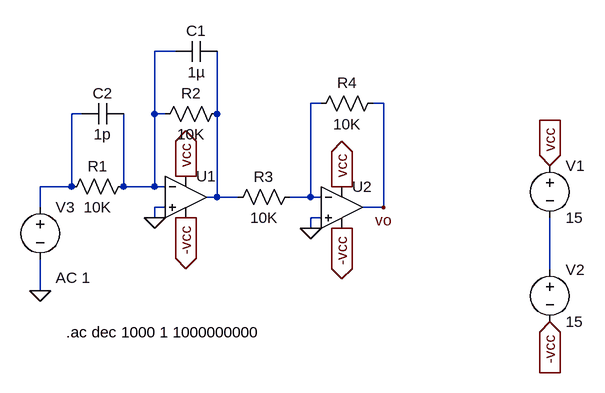
[diagram p0: schematic actividadclase.asc]
actividadclase.asc, the LTspice schematic file:
Version 4.1
SHEET 1 880 680
WIRE -592 -112 -624 -112
WIRE -368 -32 -384 -32
WIRE -272 -32 -288 -32
WIRE -736 -16 -752 -16
WIRE -624 -16 -624 -112
WIRE -608 -16 -624 -16
WIRE -528 -16 -528 -112
WIRE -752 96 -752 -16
WIRE -752 96 -800 96
WIRE -672 96 -672 -16
WIRE -624 96 -624 -16
WIRE -624 96 -672 96
WIRE -608 96 -624 96
WIRE -528 112 -528 -16
WIRE -528 112 -544 112
WIRE -496 112 -528 112
WIRE -384 112 -384 -32
WIRE -384 112 -416 112
WIRE -368 112 -384 112
WIRE -800 128 -800 96
WIRE -608 128 -624 128
WIRE -272 128 -272 -32
WIRE -272 128 -304 128
WIRE -624 144 -624 128
WIRE -368 144 -384 144
WIRE -384 160 -384 144
WIRE -16 224 -16 144
WIRE -800 256 -800 208
FLAG -16 64 vcc
IOPIN -16 64 In
FLAG -16 304 -vcc
IOPIN -16 304 In
FLAG -800 256 0
FLAG -336 96 vcc
IOPIN -336 96 Out
FLAG -576 80 vcc
IOPIN -576 80 Out
FLAG -576 144 -vcc
IOPIN -576 144 Out
FLAG -336 160 -vcc
IOPIN -336 160 Out
FLAG -272 128 vo
FLAG -624 144 0
FLAG -384 160 0
SYMBOL voltage -16 48 R0
SYMATTR InstName V1
SYMATTR Value 15
SYMBOL voltage -16 208 R0
SYMATTR InstName V2
SYMATTR Value 15
SYMBOL res -656 80 R90
WINDOW 0 0 56 VBottom 2
WINDOW 3 32 56 VTop 2
SYMATTR InstName R1
SYMATTR Value 10K
SYMBOL res -512 -32 R90
WINDOW 0 0 56 VBottom 2
WINDOW 3 32 56 VTop 2
SYMATTR InstName R2
SYMATTR Value 10K
SYMBOL res -400 96 R90
WINDOW 0 0 56 VBottom 2
WINDOW 3 32 56 VTop 2
SYMATTR InstName R3
SYMATTR Value 10K
SYMBOL res -272 -48 R90
WINDOW 0 0 56 VBottom 2
WINDOW 3 32 56 VTop 2
SYMATTR InstName R4
SYMATTR Value 10K
SYMBOL voltage -800 112 R0
WINDOW 123 24 124 Left 2
WINDOW 39 0 0 Left 0
SYMATTR InstName V3
SYMATTR Value ""
SYMATTR Value2 AC 1
SYMBOL OpAmps\\UniversalOpAmp2 -576 112 R0
SYMATTR InstName U1
SYMBOL OpAmps\\UniversalOpAmp2 -336 128 R0
SYMATTR InstName U2
SYMBOL cap -528 -128 R90
WINDOW 0 0 32 VBottom 2
WINDOW 3 32 32 VTop 2
SYMATTR InstName C1
SYMATTR Value 1µ
SYMBOL cap -672 -32 R90
WINDOW 0 0 32 VBottom 2
WINDOW 3 32 32 VTop 2
SYMATTR InstName C2
SYMATTR Value 1p
TEXT -760 320 Left 2 !.ac dec 1000 1 1000000000

The netlist it stands for:
* actividadclase.asc
V1 vcc N005 15
V2 N005 -vcc 15
R1 N001 N003 10K
R2 N004 N001 10K
R3 N002 N004 10K
R4 vo N002 10K
V3 N003 0 AC 1
X§U1 0 N001 vcc -vcc N004 level2 Avol=1Meg GBW=10Meg Slew=10Meg Ilimit=25m Rail=0 Vos=0 En=0 Enk=0 In=0 Ink=0 Rin=500Meg  ; pins In+ In- V+ V- OUT
X§U2 0 N002 vcc -vcc vo level2 Avol=1Meg GBW=10Meg Slew=10Meg Ilimit=25m Rail=0 Vos=0 En=0 Enk=0 In=0 Ink=0 Rin=500Meg  ; pins In+ In- V+ V- OUT
C1 N004 N001 1µ
C2 N001 N003 1p
.ac dec 1000 1 1000000000
.lib UniversalOpAmp2.lib
.backanno
.end

* Results of the author's LTspice run, read from the files saved beside the schematic
* Operating Point, zero values left out:
*   V(vcc) = 15 V
*   V(-vcc) = -15 V
*   I(V1) = -2.997 mA
*   I(V2) = -2.997 mA
*   Ix(u2:3) = 1.498 mA
*   Ix(u2:4) = -1.498 mA
*   Ix(u1:3) = 1.498 mA
*   Ix(u1:4) = -1.498 mA
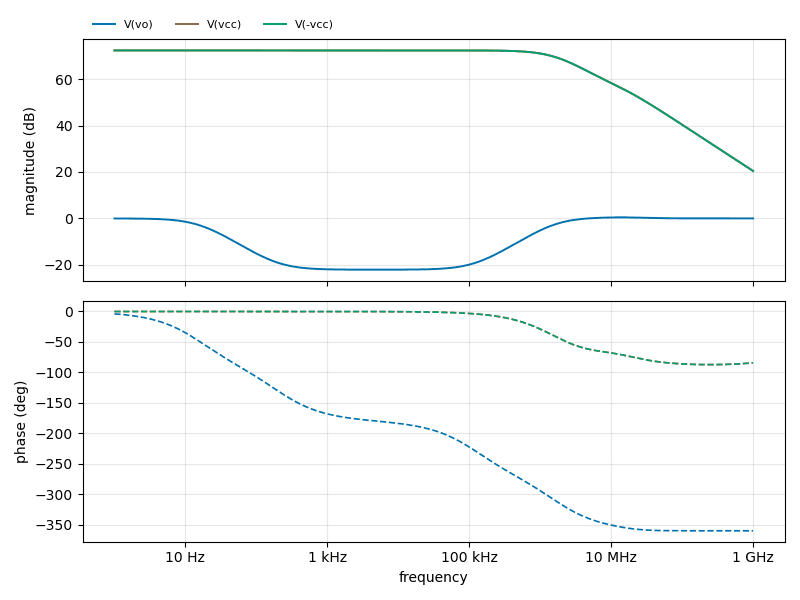
[diagram p1: AC Analysis of actividadclase.asc, plotted from the saved traces]
* AC Analysis, 1 run:
*   V(vo): -0.02 dB at 1 Hz, 0.00 dB at 1 GHz, peak 0.45 dB at 13.58 MHz, 3 dB below the peak at 1.623 MHz
*   V(vcc): 72.35 dB at 1 Hz, 20.44 dB at 1 GHz, peak 72.35 dB at 1 Hz, 3 dB below the peak at 1.687 MHz
*   V(-vcc): 72.35 dB at 1 Hz, 20.44 dB at 1 GHz, peak 72.35 dB at 1 Hz, 3 dB below the peak at 1.687 MHz